# EAGLE design Sequencer-V10-024 (EAGLE 9.5.1)
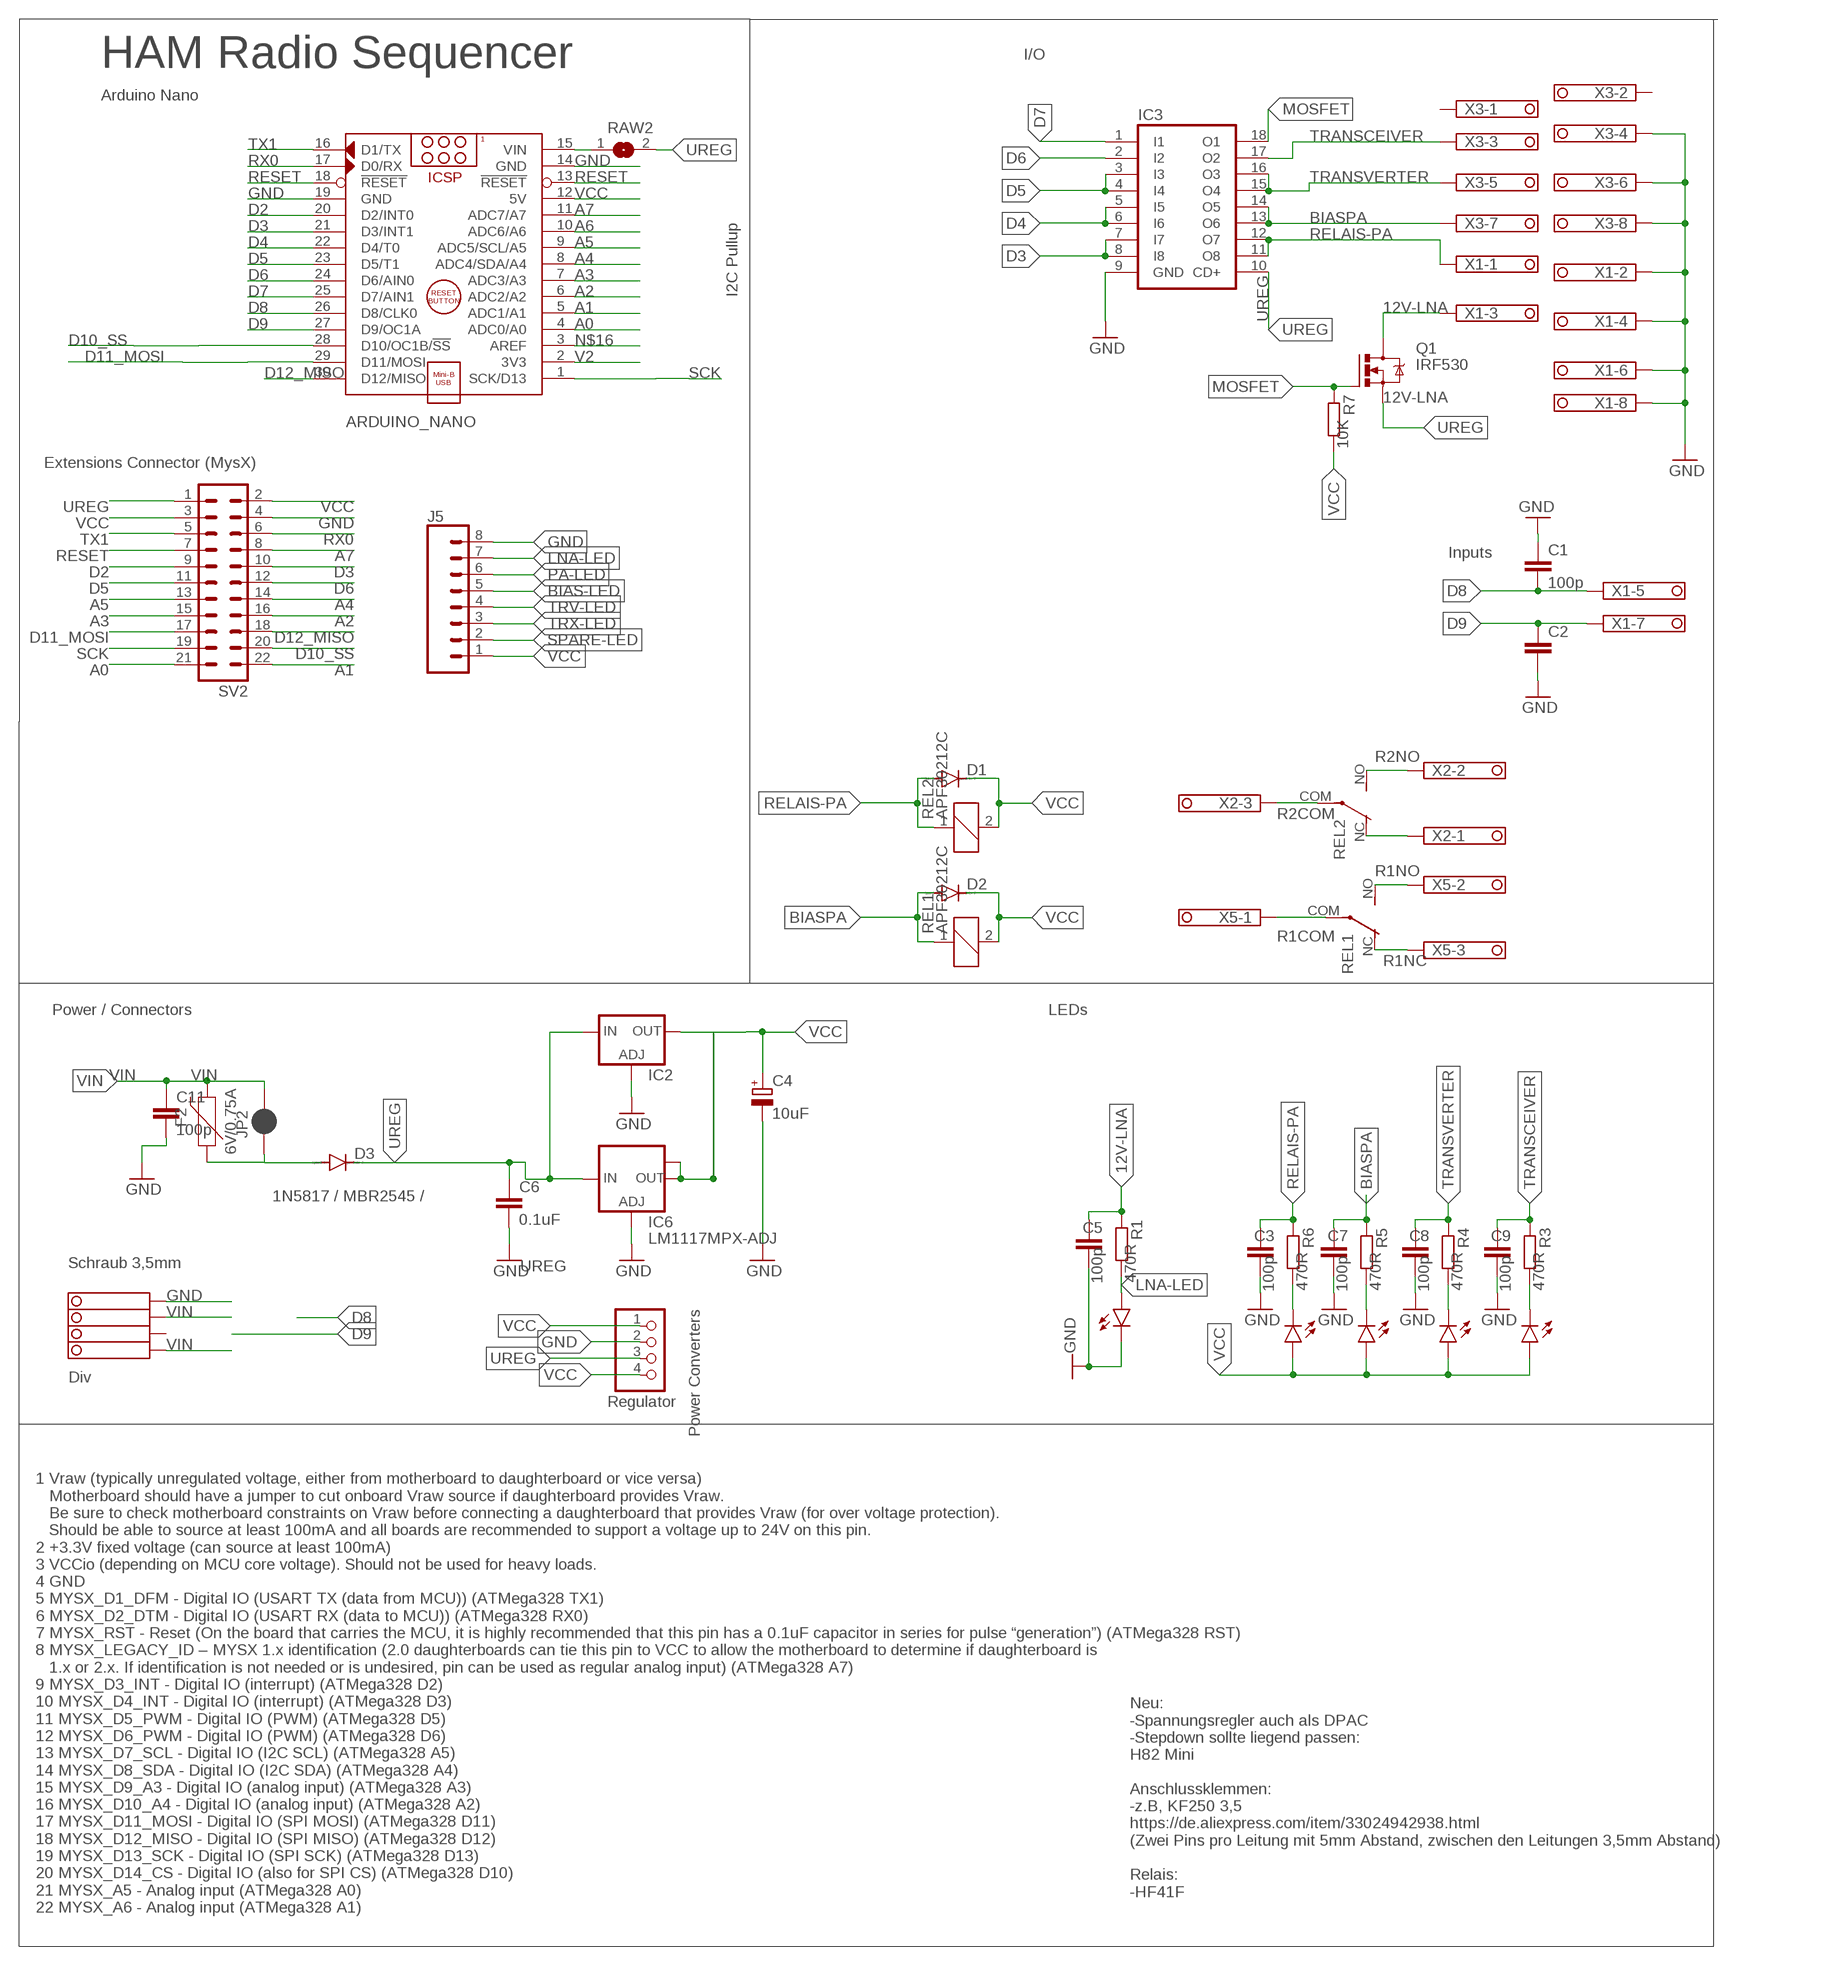
[diagram p0: schematic, sheet 1]

## Parts
ARDUINO_NANO  ARDUINO_NANO_OHNE-BOHR  [ARDUINO_NANO]
C1  100p  C-EU025-025X050  [C025-025X050]
C2  C-EU025-025X050  [C025-025X050]
C3  100p  C-EU025-025X050  [C025-025X050]
C4  10uF  CPOL-EUE3.5-8  [E3,5-8]
C5  100p  C-EU025-025X050  [C025-025X050]
C6  0.1uF  C-EU050-024X044  [C050-024X044]
C7  100p  C-EU025-025X050  [C025-025X050]
C8  100p  C-EU025-025X050  [C025-025X050]
C9  100p  C-EU025-025X050  [C025-025X050]
C11  100p  C-EU025-025X050  [C025-025X050]
D1  DIODE-D-2.5  [D-2.5]
D2  DIODE-D-2.5  [D-2.5]
D3  1N5817 / MBR2545 /  DIODE-D-7.5  [D-7.5]
F2  6V/0.75A  PPTC_THREE-QUARTER-AMP  [1206]
IC2  LD117ADT50TR  [DPACK]
IC3  ULN2803A  [DIL18]
IC6  LM1117MPX-ADJ  [SOT223]
J5  CONN_08LOCK  [1X08_LOCK]
JP2  JUMPER-SMT_2_NC_PASTE_NO-SILK  [SMT-JUMPER_2_NC_PASTE_NO-SILK]
LED-BIAS  LED3MM  [LED3MM]
LED-LNA  LED3MM  [LED3MM]
LED-PA  LED3MM  [LED3MM]
LED-TRV  LED3MM  [LED3MM]
LED-TRX  LED3MM  [LED3MM]
Q1  IRF530  [TO220BV]
R1  470R  R-EU_0207/7  [0207/7]
R3  470R  R-EU_0207/7  [0207/7]
R4  470R  R-EU_0207/7  [0207/7]
R5  470R  R-EU_0207/7  [0207/7]
R6  470R  R-EU_0207/7  [0207/7]
R7  10K  R-EU_0207/7  [0207/7]
RAW2  SJ  [SJ]
REL1  APF30212C  [APF30212C]
REL2  APF30212C  [APF30212C]
STEPDWN  PINHD-1X04_2.54-S  [1X04-S]
SV2  MA11-2  [MA11-2]
X1  MARTIN8X2-1751303  [1751303]
X2  MARTIN3X2-1751303175L303-3  [1751303-3]
X3  MARTIN8X2-1751303  [1751303]
X4  1751264  [1751264]
X5  MARTIN3X2-1751303175L303-3  [1751303-3]

## Nets
12V-LNA: C5.1 Q1.D R1.1 X1.11
A0 [Signal]: ARDUINO_NANO.4(ADC0/A0) SV2.21
A1 [Signal]: ARDUINO_NANO.5(ADC1/A1) SV2.22
A2 [Signal]: ARDUINO_NANO.6(ADC2/A2) SV2.16
A3 [Signal]: ARDUINO_NANO.7(ADC3/A3) SV2.15
A4 [Signal]: ARDUINO_NANO.8(ADC4/SDA/A4) SV2.14
A5 [Signal]: ARDUINO_NANO.9(ADC5/SCL/A5) SV2.13
A6 [Signal]: ARDUINO_NANO.10(ADC6/A6)
A7 [Signal]: ARDUINO_NANO.11(ADC7/A7) SV2.8
BIAS-LED [Signal]: J5.5 LED-BIAS.K(C) R5.2
BIASPA: C7.1 D2.A IC3.13(O6) IC3.14(O5) R5.1 REL1.1 X3.15
D2 [Signal]: ARDUINO_NANO.20(D2/INT0) SV2.9
D3 [Signal]: ARDUINO_NANO.21(D3/INT1) IC3.7(I7) IC3.8(I8) SV2.10
D4 [Signal]: ARDUINO_NANO.22(D4/T0) IC3.5(I5) IC3.6(I6)
D5 [Signal]: ARDUINO_NANO.23(D5/T1) IC3.3(I3) IC3.4(I4) SV2.11
D6 [Signal]: ARDUINO_NANO.24(D6/AIN0) IC3.2(I2) SV2.12
D7 [Signal]: ARDUINO_NANO.25(D7/AIN1) IC3.1(I1)
D8 [Signal]: ARDUINO_NANO.26(D8/CLK0) C1.2 X1.13
D9 [Signal]: ARDUINO_NANO.27(D9/OC1A) C2.1 X1.15
D10_SS [Signal]: ARDUINO_NANO.28(D10/OC1B/!SS) SV2.20
D11_MOSI [Signal]: ARDUINO_NANO.29(D11/MOSI) SV2.17
D12_MISO [Signal]: ARDUINO_NANO.30(D12/MISO) SV2.18
GND [Power]: ARDUINO_NANO.14(GND) ARDUINO_NANO.19(GND) C1.1 C2.2 C3.2 C4.- C5.2 C6.2 C7.2 C8.2 C9.2 C11.2 IC2.1(ADJ) IC3.9(GND) IC6.1(ADJ) J5.8 LED-LNA.K(C) STEPDWN.2 SV2.4 X1.10 X1.12 X1.14 X1.16 X3.12 X3.14 X3.16 X4.4
LNA-LED [Signal]: J5.7 LED-LNA.A R1.2
MOSFET: IC3.18(O1) Q1.G R7.1
N$1: D3.A F2.1 JP2.1
N$16: ARDUINO_NANO.3(AREF)
PA-LED [Signal]: J5.6 LED-PA.K(C) R6.2
R1COM: REL1.COM(2:P) X5.1
R1NC: REL1.NC(2:O) X5.3
R1NO: REL1.NO(2:S) X5.2
R2COM: REL2.COM(2:P) X2.3
R2NC: REL2.NC(2:O) X2.1
R2NO: REL2.NO(2:S) X2.2
RAW1 [Power]: ARDUINO_NANO.15(VIN) RAW2.1
RELAIS-PA: C3.1 D1.A IC3.11(O8) IC3.12(O7) R6.1 REL2.1 X1.9
RESET [Signal]: ARDUINO_NANO.13(!RESET) ARDUINO_NANO.18(!RESET) SV2.7
RX0 [Signal]: ARDUINO_NANO.17(D0/RX) SV2.6
SCK [Signal]: ARDUINO_NANO.1(SCK/D13) SV2.19
SPARE-LED [Signal]: J5.2
TRANSCEIVER: C9.1 IC3.17(O2) R3.1 X3.11
TRANSVERTER: C8.1 IC3.15(O4) IC3.16(O3) R4.1 X3.13
TRV-LED [Signal]: J5.4 LED-TRV.K(C) R4.2
TRX-LED [Signal]: J5.3 LED-TRX.K(C) R3.2
TX1 [Signal]: ARDUINO_NANO.16(D1/TX) SV2.5
UREG [Power]: C6.1 D3.C IC2.3(IN) IC3.10(CD+) IC6.3(IN) Q1.S RAW2.2 STEPDWN.3 SV2.1
V2 [Power]: ARDUINO_NANO.2(3V3)
VCC [Power]: ARDUINO_NANO.12(5V) C4.+ D1.C D2.C IC2.4(OUT) IC6.2(OUT) IC6.TAB(OUT1) J5.1 LED-BIAS.A LED-PA.A LED-TRV.A LED-TRX.A R7.2 REL1.2 REL2.2 STEPDWN.1 STEPDWN.4 SV2.2 SV2.3
VIN [Power]: C11.1 F2.2 JP2.2 X4.1 X4.3
Unconnected: X3.9 X3.10 X4.2

## Notes on the sheet
- I/O
- HAM Radio Sequencer
- Arduino Nano
- I2C Pullup
- Extensions Connector (MysX)
- Inputs
- Power / Connectors | LEDs
- Schraub 3,5mm
- Power Converters
- Div
- Regulator
- Neu:
  -Spannungsregler auch als DPAC
  -Stepdown sollte liegend passen:  
  H82 Mini
  
  Anschlussklemmen:
  -z.B, KF250 3,5 
  https://de.aliexpress.com/item/33024942938.html
  (Zwei Pins pro Leitung mit 5mm Abstand, zwischen den Leitungen 3,5mm Abstand)
  
  Relais:
  -HF41F
- 1 Vraw (typically unregulated voltage, either from motherboard to daughterboard or vice versa)
     Motherboard should have a jumper to cut onboard Vraw source if daughterboard provides Vraw. 
     Be sure to check motherboard constraints on Vraw before connecting a daughterboard that provides Vraw (for over voltage protection). 
     Should be able to source at least 100mA and all boards are recommended to support a voltage up to 24V on this pin.
  2 +3.3V fixed voltage (can source at least 100mA)
  3 VCCio (depending on MCU core voltage). Should not be used for heavy loads.
  4 GND
  5 MYSX_D1_DFM - Digital IO (USART TX (data from MCU)) (ATMega328 TX1)
  6 MYSX_D2_DTM - Digital IO (USART RX (data to MCU)) (ATMega328 RX0)
  7 MYSX_RST - Reset (On the board that carries the MCU, it is highly recommended that this pin has a 0.1uF capacitor in series for pulse “generation”) (ATMega328 RST)
  8 MYSX_LEGACY_ID – MYSX 1.x identification (2.0 daughterboards can tie this pin to VCC to allow the motherboard to determine if daughterboard is 
     1.x or 2.x. If identification is not needed or is undesired, pin can be used as regular analog input) (ATMega328 A7)
  9 MYSX_D3_INT - Digital IO (interrupt) (ATMega328 D2)
  10 MYSX_D4_INT - Digital IO (interrupt) (ATMega328 D3)
  11 MYSX_D5_PWM - Digital IO (PWM) (ATMega328 D5)
  12 MYSX_D6_PWM - Digital IO (PWM) (ATMega328 D6)
  13 MYSX_D7_SCL - Digital IO (I2C SCL) (ATMega328 A5)
  14 MYSX_D8_SDA - Digital IO (I2C SDA) (ATMega328 A4)
  15 MYSX_D9_A3 - Digital IO (analog input) (ATMega328 A3)
  16 MYSX_D10_A4 - Digital IO (analog input) (ATMega328 A2)
  17 MYSX_D11_MOSI - Digital IO (SPI MOSI) (ATMega328 D11)
  18 MYSX_D12_MISO - Digital IO (SPI MISO) (ATMega328 D12)
  19 MYSX_D13_SCK - Digital IO (SPI SCK) (ATMega328 D13)
  20 MYSX_D14_CS - Digital IO (also for SPI CS) (ATMega328 D10)
  21 MYSX_A5 - Analog input (ATMega328 A0)
  22 MYSX_A6 - Analog input (ATMega328 A1)

## Library data of the parts
ARDUINO_NANO = ArduinoNanoV30:ARDUINO_NANO_OHNE-BOHR: Arduino Nano V3.0 Module Overview: The Arduino Nano is a small, complete, and breadboard-friendly board based on the ATmega328 (Arduino Nano 3.x) or ATmega168 (Arduino Nano 2.x). It has more or less the same functionality of the Arduino Duemilanove, but in a different package. It lacks only a DC power jack, and works with a Mini-B USB cable instead of a standard one. The Nano was designed and is being produced by Gravitech <http://www.gravitech.us/arna30wiatp.html>. General specifications: Item Value Microcontroller Atmel ATmega168 or ATmega328 Operating Voltage (logic level) 5 V Input Voltage (recommended) 7-12 V Input Voltage (limits) 6-20 V Digital I/O Pins 14 (of which 6 provide PWM output) Analog Input Pins 8 DC Current per I/O Pin 40 mA Flash Memory 16 KB (ATmega168) or 32 KB (ATmega328) of which 2 KB used by bootloader SRAM 1 KB (ATmega168) or 2 KB (ATmega328) EEPROM 512 bytes (ATmega168) or 1 KB (ATmega328) Clock Speed 16 MHz Dimensions (Inches) 0.73" x 1.70" Dimensions (mm) 18mm x 45mm Overall height About 9 mm (not including pins) Weigth 5 g Power: The Arduino Nano can be powered via the Mini-B USB connection, 6-20V unregulated external power supply (pin 30), or 5V regulated external power supply (pin 27). The power source is automatically selected to the highest voltage source. Memory: The ATmega168 has 16 KB of flash memory for storing code (of which 2 KB is used for the bootloader); the ATmega328 has 32 KB, (also with 2 KB used for the bootloader). The ATmega168 has 1 KB of SRAM and 512 bytes of EEPROM (which can be read and written with the EEPROM library); the ATmega328 has 2 KB of SRAM and 1 KB of EEPROM. Input and Output: Each of the 14 digital pins on the Nano can be used as an input or output, using pinMode(), digitalWrite(), and digitalRead() functions. They operate at 5 volts. Each pin can provide or receive a maximum of 40 mA and has an internal pull-up resistor (disconnected by default) of 20-50 kOhms. In addition, some pins have specialized functions. Visit Arduino - ArduinoBoardNano <https://www.arduino.cc/en/Main/ArduinoBoardNano>
C1-C3 C5-C9 C11 = rcl:C-EU: CAPACITOR, European symbol; SPICEPREFIX: C
C4 = rcl:CPOL-EU: POLARIZED CAPACITOR, European symbol; SPICEPREFIX: C
D1-D3 = diode:DIODE-: DIODE
F2 = SparkFun-Fuses:PPTC: Resettable Fuse PPTC Resettable Fuse. Really a sort of resistor with a polymeric positive temperature coefficient whose resistance increases dramatically with an increase in temperature. When heated by the power passing through the resistance rises causing the current to be limited, protecting the circuit. This is achieved by the transition of the polymer from a crystalline to an amorphous state where the conductive carbon separates breaking the conductive pathways found in the cool crystalline structure. When a PPTC cools back down it resumes conducting letting the circuit turn back on. SparkFun Products: SparkFun RedBoard - Programmed with Arduino <https://www.sparkfun.com/products/12757> Pro Micro - 5V/16MHz <https://www.sparkfun.com/products/12640> Arduino Pro 328 - 5V/16MHz <https://www.sparkfun.com/products/10915> MP3 Trigger <https://www.sparkfun.com/products/13720>; PROD_ID: RES-11150
IC2 = v-reg:LD117A?*: Low drop fixed and adjustable positive voltage regulators 1 A Source: http://www.st.com/stonline/products/literature/ds/7194/ld1117axx.pdf
IC3 = uln-udn:ULN2803A: DRIVER ARRAY
IC6 = lm1117:LM1117MPX-ADJ
J5 = SparkFun-Connectors:CONN_08: Multi connection point. Often used as Generic Header-pin footprint for 0.1 inch spaced/style header connections On any of the 0.1 inch spaced packages, you can populate with these: Break Away Headers - Straight <https://www.sparkfun.com/products/116> (PRT-00116) Break Away Male Headers - Right Angle <https://www.sparkfun.com/products/553> (PRT-00553) Female Headers <https://www.sparkfun.com/products/115> (PRT-00115) Break Away Headers - Machine Pin <https://www.sparkfun.com/products/117> (PRT-00117) Break Away Female Headers - Swiss Machine Pin <https://www.sparkfun.com/products/743> (PRT-00743) Arduino Stackable Header - 8 Pin <https://www.sparkfun.com/products/9279> (PRT-09279) For SCREWTERMINALS and SPRING TERMINALS visit here: Screw Terimnals on SparkFun.com <https://www.sparkfun.com/search/results?term=Screw+Terminals> (5mm/3.5mm/2.54mm spacing) This device is also useful as a general connection point to wire up your design to another part of your project. Our various solder wires solder well into these plated through hole pads. Hook-Up Wire - Assortment (Stranded, 22 AWG) <https://www.sparkfun.com/products/11375> (PRT-11375) Hook-Up Wire - Assortment (Solid Core, 22 AWG) <https://www.sparkfun.com/products/11367> (PRT-11367) View the entire wire category on our website here <https://www.sparkfun.com/categories/141> Special notes: Molex polarized connector foot print use with SKU : PRT-08231 with associated crimp pins and housings. 1MM SMD Version SKU: PRT-10208 NOTES ON THE VARIANTS LOCK and LOCK_LONGPADS... This footprint was designed to help hold the alignment of a through-hole component (i.e. 6-pin header) while soldering it into place. You may notice that each hole has been shifted either up or down by 0.005 of an inch from it's more standard position (which is a perfectly straight line). This slight alteration caused the pins (the squares in the middle) to touch the edges of the holes. Because they are alternating, it causes a "brace" to hold the component in place. 0.005 has proven to be the perfect amount of "off-center" position when using our standard breakaway headers. Although looks a little odd when you look at the bare footprint, once you have a header in there, the alteration is very hard to notice. Also,if you push a header all the way into place, it is covered up entirely on the bottom side.
JP2 = SparkFun-Jumpers:JUMPER-SMT_2_NC_PASTE: Normally closed solder jumper This jumper has an aperture in the stencil to allow solder paste to bridge the split in the wire so it's normally closed (NC). Wick off the solder to open the connection. Reapply solder to reclose the connection.
LED-BIAS LED-LNA LED-PA LED-TRV LED-TRX = led:LED: LED OSRAM: - CHIPLED LG R971, LG N971, LY N971, LG Q971, LY Q971, LO R971, LY R971 LH N974, LH R974 LS Q976, LO Q976, LY Q976 LO Q996 - Hyper CHIPLED LW Q18S LB Q993, LB Q99A, LB R99A - SideLED LS A670, LO A670, LY A670, LG A670, LP A670 LB A673, LV A673, LT A673, LW A673 LH A674 LY A675 LS A676, LA A676, LO A676, LY A676, LW A676 LS A679, LY A679, LG A679 - Hyper Micro SIDELED® LS Y876, LA Y876, LO Y876, LY Y876 LT Y87S - SmartLED LW L88C, LW L88S LB L89C, LB L89S, LG L890 LS L89K, LO L89K, LY L89K LS L896, LA L896, LO L896, LY L896 - TOPLED LS T670, LO T670, LY T670, LG T670, LP T670 LSG T670, LSP T670, LSY T670, LOP T670, LYG T670 LG T671, LOG T671, LSG T671 LB T673, LV T673, LT T673, LW T673 LH T674 LS T676, LA T676, LO T676, LY T676, LB T676, LH T676, LSB T676, LW T676 LB T67C, LV T67C, LT T67C, LS T67K, LO T67K, LY T67K, LW E67C LS E67B, LA E67B, LO E67B, LY E67B, LB E67C, LV E67C, LT E67C LW T67C LS T679, LY T679, LG T679 LS T770, LO T770, LY T770, LG T770, LP T770 LB T773, LV T773, LT T773, LW T773 LH T774 LS E675, LA E675, LY E675, LS T675 LS T776, LA T776, LO T776, LY T776, LB T776 LHGB T686 LT T68C, LB T68C - Hyper Mini TOPLED® LB M676 - Mini TOPLED Santana® LG M470 LS M47K, LO M47K, LY M47K Source: http://www.osram.convergy.de LUXEON: - LUMILED® LXK2-PW12-R00, LXK2-PW12-S00, LXK2-PW14-U00, LXK2-PW14-V00 LXK2-PM12-R00, LXK2-PM12-S00, LXK2-PM14-U00 LXK2-PE12-Q00, LXK2-PE12-R00, LXK2-PE12-S00, LXK2-PE14-T00, LXK2-PE14-U00 LXK2-PB12-K00, LXK2-PB12-L00, LXK2-PB12-M00, LXK2-PB14-N00, LXK2-PB14-P00, LXK2-PB14-Q00 LXK2-PR12-L00, LXK2-PR12-M00, LXK2-PR14-Q00, LXK2-PR14-R00 LXK2-PD12-Q00, LXK2-PD12-R00, LXK2-PD12-S00 LXK2-PH12-R00, LXK2-PH12-S00 LXK2-PL12-P00, LXK2-PL12-Q00, LXK2-PL12-R00 Source: www.luxeon.com KINGBRIGHT: KA-3528ASYC Source: www.kingbright.com
Q1 = transistor-power:IRF530: HEXFET Power MOSFET
R1 R3-R7 = rcl:R-EU_: RESISTOR, European symbol; SPICEPREFIX: R
RAW2 = jumper:SJ: SMD solder JUMPER
REL1 REL2 = relay:APF30212C: Compliant with European standards 1a/1c 6A Slim power relays Source: Data sheet <http://pewa.panasonic.com/assets/pcsd/catalog/pf-catalog.pdf>; OC_FARNELL: unknown
STEPDWN = pinhead-2:PINHD-1X04: PIN HEADER
SV2 = con-Pinheader:MA11-2: PIN HEADER; OC_FARNELL: unknown; OC_NEWARK: unknown
X1 X3 = con-phoenix-350-Martin:MARTIN8X2-1751303: MKDS 1/ 8-3,5 Printklemme Nennstrom: 10 A Bemessungsspannung: 160 V Raster: 3,5 mm Polzahl: 8 Montageart: Löten Anschlussart: Schraubanschluss Anschlussrichtung vom Leiter zur Platine: 0° Source: http://eshop.phoenixcontact.com .. .pdf; OC_FARNELL: unknown; OC_NEWARK: unknown
X2 X5 = con-phoenix-350-Martin:MARTIN3X2-1751303: MKDS 1/ 8-3,5 Printklemme Nennstrom: 10 A Bemessungsspannung: 160 V Raster: 3,5 mm Polzahl: 8 Montageart: Löten Anschlussart: Schraubanschluss Anschlussrichtung vom Leiter zur Platine: 0° Source: http://eshop.phoenixcontact.com .. .pdf
X4 = con-phoenix-350:1751264: MKDS 1/ 4-3,5 Printklemme Nennstrom: 10 A Bemessungsspannung: 160 V Raster: 3,5 mm Polzahl: 4 Montageart: Löten Anschlussart: Schraubanschluss Anschlussrichtung vom Leiter zur Platine: 0° Source: http://eshop.phoenixcontact.com .. 1751264.pdf; MPN: 1751264; OC_FARNELL: unknown; OC_NEWARK: 10R0934

## Net classes
0 default: width 1.219 mm
1 Power: width 0.762 mm
2 Signal: width 0.305 mm

## Board
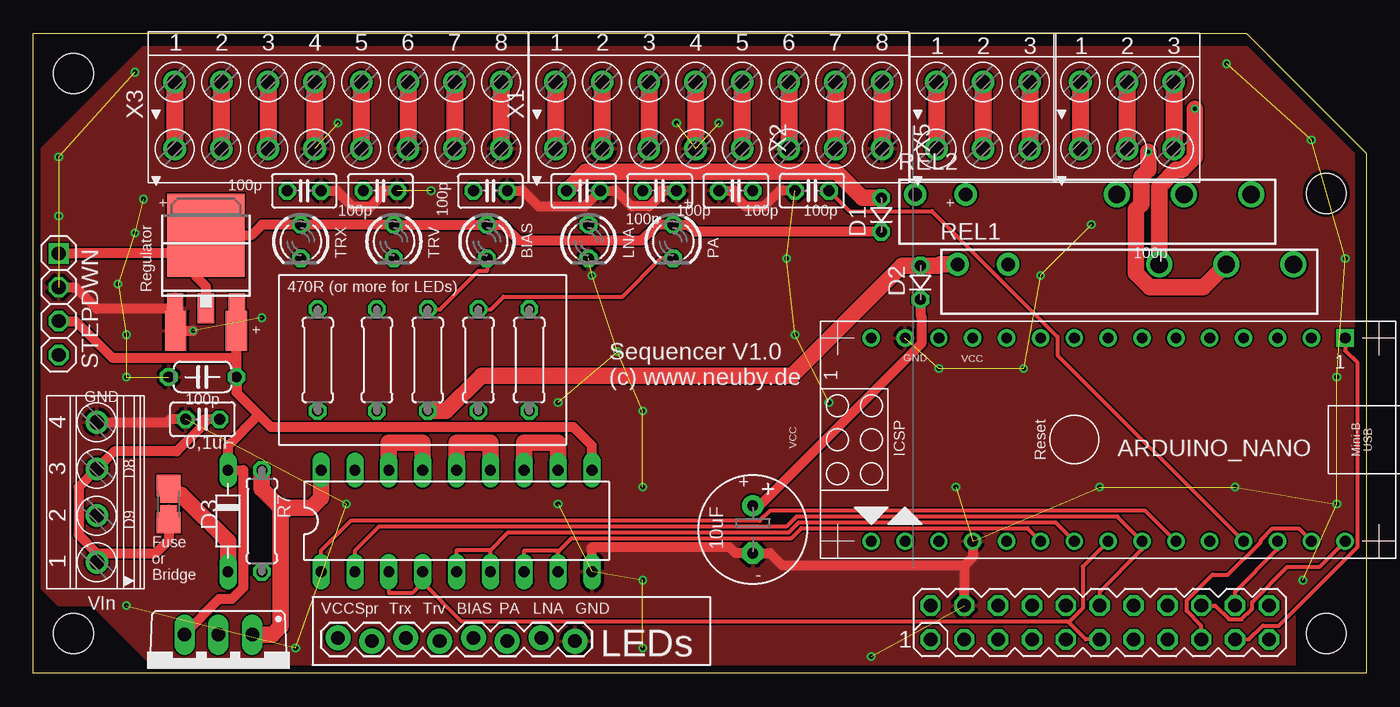
[diagram p1: board, top side]
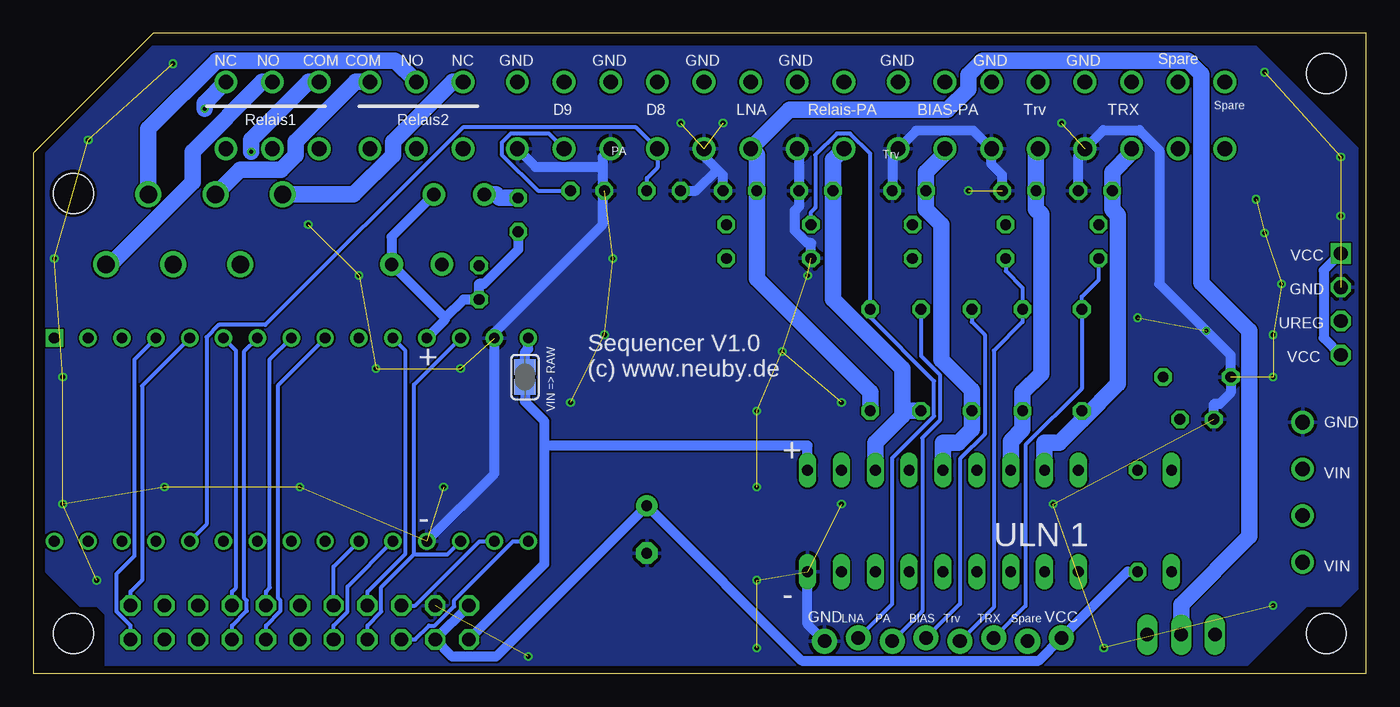
[diagram p2: board, bottom side, seen from below]

Size 100 x 48 mm. Coordinates in mm from the lower left corner, seen from the top.
Outline: 100,0 0,0 0,48 91,48 100,39 100,0
Copper layers (1*16): Top 0.035mm / dielectric 1.5mm / Bottom 0.035mm
Design rules "dirt_cheap_dirty_boards.v1": minimum track width 5mil, minimum drill 12mil, track to track 5mil, track to pad 5mil, pad to pad 5mil, via to via 5mil, smd to smd 0mil, copper to edge 10mil, drill to drill 10mil, minimum pad ring 10mil, minimum via ring 6mil, stop-mask expansion 2mil, vias tented up to drill 25mil, thermal gap 10mil
Holes 3 mm at 3,45 97,36 97,3 3,3

### Footprints (pad centres in the part's own frame; a part is rotated, then mirrored left to right if it is on the bottom)
ARDUINO_NANO = drill 0.8 square: 1 -20.32,-7.62 | drill 0.8: 2 -17.78,-7.62; 3 -15.24,-7.62; 4 -12.7,-7.62; 5 -10.16,-7.62; 6 -7.62,-7.62; 7 -5.08,-7.62; 8 -2.54,-7.62; 9 0,-7.62; 10 2.54,-7.62; 11 5.08,-7.62; 12 7.62,-7.62; 13 10.16,-7.62; 14 12.7,-7.62; 15 15.24,-7.62; 16 15.24,7.62; 17 12.7,7.62; 18 10.16,7.62; 19 7.62,7.62; 20 5.08,7.62; 21 2.54,7.62; 22 0,7.62; 23 -2.54,7.62; 24 -5.08,7.62; 25 -7.62,7.62; 26 -10.16,7.62; 27 -12.7,7.62; 28 -15.24,7.62; 29 -17.78,7.62; 30 -20.32,7.62
C025-025X050 = drill 0.813 octagon: 1 -1.27,0; 2 1.27,0
E3,5-8 = drill 0.813 pad 1.6: + -1.778,0 | drill 0.813 pad 1.6 octagon: - 1.778,0
C050-024X044 = drill 0.813 octagon: 1 -2.54,0; 2 2.54,0
D-2.5 = drill 0.813 octagon: A 1.27,0; C -1.27,0
D-7.5 = drill 0.813 long: A 3.81,0; C -3.81,0
1206 = smd 1.6 x 1.8: 1 -1.4,0; 2 1.4,0
DPACK = smd 1.6 x 3: 1 -2.28,-4.8; 3 2.28,-4.8 | smd 5.8 x 6.2: 4 0,2.38
DIL18 = drill 0.813 long: 1 -10.16,-3.81; 2 -7.62,-3.81; 3 -5.08,-3.81; 4 -2.54,-3.81; 5 0,-3.81; 6 2.54,-3.81; 7 5.08,-3.81; 8 7.62,-3.81; 9 10.16,-3.81; 10 10.16,3.81; 11 7.62,3.81; 12 5.08,3.81; 13 2.54,3.81; 14 0,3.81; 15 -2.54,3.81; 16 -5.08,3.81; 17 -7.62,3.81; 18 -10.16,3.81
SOT223 = smd 1.219 x 2.235: 1 -2.311,-3.099; 2 0,-3.099; 3 2.311,-3.099 | smd 3.6 x 2.2: TAB 0,3.099
1X08_LOCK = drill 1.016 pad 1.88: 1 0,0.127; 2 2.54,-0.127; 3 5.08,0.127; 4 7.62,-0.127; 5 10.16,0.127; 6 12.7,-0.127; 7 15.24,0.127; 8 17.78,-0.127
SMT-JUMPER_2_NC_PASTE_NO-SILK = smd 0.635 x 1.27: 1 -0.406,0; 2 0.406,0
LED3MM = drill 0.813 octagon: A -1.27,0; K 1.27,0
TO220BV = drill 1.016 long: D 0,-2.54; G -2.54,-2.54; S 2.54,-2.54
0207/7 = drill 0.813 octagon: 1 -3.81,0; 2 3.81,0
SJ = smd 1.168 x 1.6: 1 -0.762,0; 2 0.762,0
APF30212C = drill 1 pad 1.7: 1 -12.6,0; 2 -8.82,0 | drill 1.3 pad 1.9: COM 7.56,0; NC 2.52,0; NO 12.6,0
1X04-S = drill 1.016 square: 1 -3.81,0 | drill 1.016 octagon: 2 -1.27,0; 3 1.27,0; 4 3.81,0
MA11-2 = drill 1.016 octagon: 1 -12.7,-1.27; 2 -12.7,1.27; 3 -10.16,-1.27; 4 -10.16,1.27; 5 -7.62,-1.27; 6 -7.62,1.27; 7 -5.08,-1.27; 8 -5.08,1.27; 9 -2.54,-1.27; 10 -2.54,1.27; 11 0,-1.27; 12 0,1.27; 13 2.54,-1.27; 14 2.54,1.27; 15 5.08,-1.27; 16 5.08,1.27; 17 7.62,-1.27; 18 7.62,1.27; 19 10.16,-1.27; 20 10.16,1.27; 21 12.7,-1.27; 22 12.7,1.27
1751303 = drill 1.1 pad 1.7: 1 -12.25,-0.1; 2 -8.75,-0.1; 3 -5.25,-0.1; 4 -1.75,-0.1; 5 1.75,-0.1; 6 5.25,-0.1; 7 8.75,-0.1; 8 12.25,-0.1; 9 -12.25,-5.1; 10 -8.75,-5.1; 11 -5.25,-5.1; 12 -1.75,-5.1; 13 1.75,-5.1; 14 5.25,-5.1; 15 8.75,-5.1; 16 12.25,-5.1
1751303-3 = drill 1.1 pad 1.7: 1 -3.36,2.44; 2 0.14,2.44; 3 3.64,2.44; 4 -3.36,-2.56; 5 0.14,-2.56; 6 3.64,-2.56
1751264 = drill 1.1 pad 1.7: 1 -5.25,-0.1; 2 -1.75,-0.1; 3 1.75,-0.1; 4 5.25,-0.1

### Placement (x,y rotation side)
ARDUINO_NANO  78.11,17.52 180 top
C1  52.7,36.2 0 top
C2  58.42,36.2 180 top
C3  41.27,36.2 0 top
C4  53.98,10.79 270 top
C5  46.99,36.2 0 top
C6  12.7,22.23 180 top
C7  34.29,36.2 0 top
C8  26.04,36.2 0 top
C9  20.32,36.2 0 top
C11  12.7,19.05 180 top
D1  63.62,34.38 90 top
D2  66.56,29.3 90 top
D3  14.61,11.43 270 top
F2  10.16,12.7 270 top
IC2  12.96,30.48 0 top
IC3  31.75,11.43 0 top
IC6  12.96,30.48 0 top
J5  22.86,2.54 0 top
JP2  10.16,12.7 270 top
LED-BIAS  34.03,32.38 270 top
LED-LNA  41.66,32.38 270 top
LED-PA  48.01,32.38 270 top
LED-TRV  27.05,32.38 270 top
LED-TRX  20.07,32.38 270 top
Q1  13.88,0.36 180 top
R1  37.21,23.5 90 top
R3  21.34,23.5 90 top
R4  25.78,23.5 90 top
R5  29.59,23.5 90 top
R6  33.4,23.5 90 top
R7  17.14,11.43 270 top
RAW2  63.12,22.23 270 bottom
REL1  81.94,30.68 0 top
REL2  78.77,35.91 0 top
STEPDWN  1.91,27.68 270 top
SV2  80.01,3.81 0 top
X1  51.44,44.45 0 top
X2  71.12,41.91 0 top
X3  22.86,44.45 0 top
X4  4.67,13.59 90 top
X5  81.92,41.91 0 top

### Tracks (layer width: path | path; a pad name or v marks a point on that pad's centre or on a via)
12V-LNA
  Bottom 1.219: Q1.D 13.88,5.16 8.76,10.29 8.76,25.68 12.36,29.28 12.36,44.93 13.38,45.95 28.79,45.95 29.86,44.88 29.86,43.81 31.41,42.26 43.27,42.26 X1.11 45.72,38.88 C5.1 45.72,29.59 37.21,21.08 R1.1
A0
  Bottom 0.305: SV2.21 92.71,3.58 93.75,4.62 93.75,7.47 92.41,8.81 92.41,23.54 ARDUINO_NANO.4
A1
  Bottom 0.305: ARDUINO_NANO.5 91.85,21.56 91.85,6.99 92.71,6.12 SV2.22
A2
  Bottom 0.305: SV2.16 85.09,6.12 84.78,6.43 84.78,24.2 ARDUINO_NANO.6
A3
  Bottom 0.305: SV2.15 85.09,3.58 83.99,4.68 83.99,5.46 84.17,5.63 84.17,24.16 ARDUINO_NANO.7
A4
  Bottom 0.305: SV2.14 82.55,6.12 82.25,6.42 82.25,23.54 ARDUINO_NANO.8
A5
  Bottom 0.305: SV2.13 82.55,3.58 81.45,4.68 81.45,5.46 81.63,5.63 81.63,21.62 ARDUINO_NANO.9
A7
  Bottom 0.305: SV2.8 74.93,6.12 72.07,8.98 72.07,24.19 ARDUINO_NANO.11
BIAS-LED
  Top 0.305: LED-BIAS.K 34.03,30.18 33.4,30.18 30.53,27.3 R5.2
  Bottom 0.305: R5.2 29.59,26.36 28.62,25.39 28.62,17.94 30.48,16.08 30.48,5.21 J5.5
BIASPA
  Top 1.219: IC3.13 34.29,17.3 31.75,17.3 IC3.14 | R5.1 30.99,19.68 33.62,22.32 56.91,22.32 65.16,30.57 D2.A 67.26,30.57 67.96,30.57 68.06,30.68 REL1.1
  Bottom 1.219: IC3.14 31.75,17.3 30.58,17.3 29.59,18.29 R5.1 29.59,21.25 31.88,23.54 31.88,33.66 33.02,34.8 C7.1 33.02,37.59 31.61,39 X3.15
D2
  Bottom 0.305: SV2.9 77.47,3.58 76.43,4.62 76.43,6.5 ARDUINO_NANO.20
D3
  Top 0.305: 39.37,9.11 40.39,10.13 56.86,10.13 57.62,10.89 74.58,10.89 ARDUINO_NANO.21 | 39.37,9.11 39.26,9.22 36.83,9.22 IC3.7 | IC3.8 39.37,9.11
  Bottom 0.305: SV2.10 77.47,8 ARDUINO_NANO.21
D4
  Top 0.305: 34.29,9.22 35.64,10.57 56.69,10.57 57.44,11.32 76.69,11.32 ARDUINO_NANO.22 | 34.29,9.22 | IC3.6 34.29,9.11 34.29,9.22 | IC3.5 31.75,9.22 34.29,9.22
D5
  Top 0.305: 77.69,3.82 77.62,3.89 32.14,3.89 29.21,6.82 | 77.69,3.82 78.97,2.54 SV2.11 | ARDUINO_NANO.23 78.74,8 78.74,4.87 77.69,3.82 | IC3.3 26.67,6.02 28.41,6.02 29.21,6.82 | IC3.4 29.21,6.82
D6
  Top 0.305: IC3.2 24.13,9.22 25.91,11 56.51,11 57.26,11.76 81.33,11.76 ARDUINO_NANO.24 83.19,9.3 80.01,6.12 SV2.12
D7
  Top 0.305: ARDUINO_NANO.25 83.44,12.19 55.25,12.19 54.49,11.43 23.8,11.43 21.59,9.22 IC3.1
D8
  Bottom 0.305: ARDUINO_NANO.26 87,11.18 87,25.23 86.09,26.13 82.59,26.13 67.77,40.95 54.79,40.95 X1.13 53.19,37.92 53.98,37.13 53.98,36.66 C1.2
D9
  Top 0.305: C2.1 61.23,34.66 67.43,34.66 76.83,25.26 76.83,23.88 ARDUINO_NANO.27
  Bottom 0.305: X1.15 61.31,40.48 64.17,40.48 64.86,39.8 64.86,38.9 62.15,36.2 C2.1
D10_SS
  Top 0.305: SV2.20 90.17,6.12 93.34,9.3 ARDUINO_NANO.28
D11_MOSI
  Top 0.305: SV2.17 87.63,3.58 86.53,4.68 86.53,5.47 88.46,7.39 89.62,7.39 92.08,9.85 92.08,9.97 92.97,10.86 94.93,10.86 ARDUINO_NANO.29
D12_MISO
  Top 0.305: SV2.18 88.67,5.08 89.71,4.04 90.64,4.04 91.44,4.83 91.44,5.34 94.08,7.98 96.5,7.98 ARDUINO_NANO.30
GND  (via drill 0.3 pad 0.61, 0.35)  (41 unrouted)
  Top 0.762: C11.2 10.26,19.05 10.05,18.84 X4.4 | STEPDWN.2 3.17,28.95 4.79,27.34 10.64,27.34 | 10.64,27.34 10.64,27.3 10.64,27.12 10.64,25.75 10.68,25.72 IC2.1 v11.98,25.68 | IC6.1 10.64,27.34 | C7.2 36.73,36.2 37.91,35.01 41.36,35.01 C3.2 43.71,36.2 44.88,35.03 46.22,35.03 47.09,35.9 47.09,36.2 C5.2 | 69.85,8.09 56.21,8.09 55.28,9.02 C4.- 52.67,9.02 52.23,9.45 41.91,9.45 IC3.9 | ARDUINO_NANO.19 70.48,8.72 69.85,8.09 | 69.85,8.09 69.85,6.35 SV2.4 | C8.2 26.14,36.2 26.14,35.83 25.33,35.03 23.93,35.03 22.76,36.2 C9.2 | C1.1 52.6,36.2 52.6,35.83 53.44,34.99 54.78,34.99 55.98,36.2 C2.2
  Bottom 0.762: 57.26,36.2 57.26,33.7 65.41,25.55 ARDUINO_NANO.14 65.41,14.98 ARDUINO_NANO.19 | 57.26,37.99 57.26,38.77 X1.14 | 57.26,36.2 57.26,37.99 | X1.16 62.32,37.99 57.26,37.99 | C2.2 57.26,36.2 | C11.2 11.43,20.22 11,20.22 10.16,21.06 C6.2 10.16,23.86 v11.98,25.68 15.52,29.22 15.52,39.24 17.02,40.73 19.73,40.73 X3.12 21.59,38.87 C9.2 | 48.68,37.78 48.26,37.36 C5.2 | X1.12 49.69,38.79 48.68,37.78 | 48.68,37.78 50.27,36.2 C1.1 | C8.2 27.3,37.36 28.11,38.17 X3.14 29.47,40.71 33.75,40.71 X3.16 35.56,38.9 C7.2 | LED-LNA.K 41.66,32.28 41.95,32.28 42.86,33.2 42.86,34.71 42.55,35.03 C3.2 42.55,39.21 X1.10 | J5.8 41.91,3.68 IC3.9
  other vias: 1.91,38.73 7.62,45.09 7.62,33.02 6.35,29.21 6.99,25.4 6.99,22.23 6.99,5.08 19.68,1.91 23.5,12.7 17.14,26.67 29.84,36.2 41.91,29.84 43.81,24.13 39.37,20.32 59.69,20.32 39.37,12.7 45.72,1.91 45.72,6.99 45.72,13.97 45.72,19.68 56.52,31.11 57.15,25.4 62.87,1.27 69.22,13.97 67.94,22.86 75.56,29.84 79.38,33.66 89.53,45.72 95.89,40.01 98.42,31.11 97.79,22.23 97.79,12.7 90.17,13.97 80.01,13.97 74.3,22.86 95.25,6.99 1.91,34.29 8.26,35.56 22.86,41.27 48.26,41.27 51.44,41.27
  pour Top: 0.64,6.35 0.64,39.37 8.26,46.99 91.08,46.99 99.06,39.01 99.06,7.62 96.52,5.08 95.25,5.08 94.61,4.45 94.61,0.64 8.89,0.64 4.45,5.08 1.91,5.08
  pour Bottom: 8.89,0.64 4.45,5.08 1.91,5.08 0.64,6.35 0.64,39.37 8.26,46.99 91.08,46.99 99.06,39.01 99.06,7.62 96.52,5.08 95.25,5.08 94.61,4.45 94.61,0.64
LNA-LED
  Bottom 0.305: J5.7 35.56,5.21 35.56,16.15 32.43,19.29 32.43,21.91 37.21,26.69 R1.2 37.21,38.97 38.72,40.48 39.72,40.48 41.32,38.88 41.32,34.93 41.66,34.59 LED-LNA.A
MOSFET
  Top 1.219: 18.56,12.43 17.14,13.84 R7.1 | 18.56,12.43 18.56,3.54 17.92,2.9 Q1.G | 18.56,12.43 20.84,12.43 21.59,13.18 IC3.18
N$1
  Top 0.635: 10.16,13.4 JP2.1
  Top 1.219: D3.A 14.61,9.89 11.1,13.4 10.16,13.4 F2.1
PA-LED
  Top 0.305: LED-PA.K 47.06,31.11 44.2,28.25 35.28,28.25 34.34,27.3 R6.2
  Bottom 0.305: R6.2 33.4,23.8 31.99,22.39 31.99,18.98 33.31,17.66 33.31,4.67 J5.6
R1COM  (via drill 0.3 pad 0.61)
  Top 1.219: v83.64,39.11 83.64,37.76 83.12,37.24 83.12,35.16 82.73,34.77 82.73,29.99 83.77,28.95 87.78,28.95 REL1.COM
  Bottom 1.219: X5.1 79.33,44.35 83.64,40.03 v83.64,39.11
R1NC  (via drill 0.3 pad 0.61)
  Top 1.219: v87.14,42.36 87.14,38.69 86.22,37.76 85.72,37.76 84.47,36.51 REL1.NC
  Bottom 1.219: X5.3 87.14,42.76 v87.14,42.36
R1NO
  Bottom 1.219: REL1.NO 94.18,30.68 88.04,36.82 88.04,39.12 82.81,44.35 X5.2
R2COM
  Bottom 1.219: X2.3 75.83,44.35 80.31,39.88 80.31,38.85 81.39,37.76 84.48,37.76 REL2.COM
R2NC
  Bottom 1.219: X2.1 68.55,44.35 73.01,39.89 73.01,38.86 75.95,35.91 REL2.NC
R2NO
  Bottom 1.219: REL2.NO 91.37,40.83 86.26,45.94 72.85,45.94 X2.2
RAW1
  Bottom 0.762: RAW2.1 63.12,24.08 62.87,24.33 ARDUINO_NANO.15
RELAIS-PA
  Top 1.219: D1.A 62.22,35.66 60.27,37.61 41.42,37.61 C3.1 | IC3.11 39.37,17.3 36.83,17.3 IC3.12
  Bottom 1.219: 34.8,19.68 34.8,22.85 40.01,28.05 40.01,34.8 C3.1 40.01,38.53 X1.9 | D1.A 65.02,35.66 65.28,35.91 REL2.1 | R6.1 34.8,19.68 | 34.8,19.68 34.8,19.33 36.83,17.3 IC3.12
RESET
  Bottom 0.305: 71.44,8.93 68.92,8.93 ARDUINO_NANO.18 | 71.44,8.93 73.89,6.47 73.89,4.62 74.93,3.58 SV2.7 | 71.44,8.93 71.44,21.65 ARDUINO_NANO.13
RX0
  Bottom 0.305: SV2.6 71.35,5.08 66.52,9.9 ARDUINO_NANO.17
SCK
  Top 0.305: ARDUINO_NANO.1 98.42,24.21 99.36,23.28 99.36,9.49 93.44,3.58 92.25,3.58 91.21,2.54 SV2.19
TRANSCEIVER
  Bottom 1.219: IC3.17 24.13,17.3 23.02,17.3 21.34,18.99 | 21.34,18.99 18.62,21.7 18.62,34.37 19.05,34.8 C9.1 19.05,37.59 17.61,39.03 X3.11 | R3.1 21.34,18.99
TRANSVERTER
  Top 1.219: IC3.15 29.21,17.3 26.67,17.3 IC3.16
  Bottom 1.219: X3.13 24.77,39.2 C8.1 24.77,34.8 24.38,34.41 24.38,22.48 25.78,21.08 R4.1 25.78,18.99 25.78,18.29 26.67,17.4 IC3.16
TRV-LED
  Bottom 0.305: J5.4 27.94,4.95 27.94,24.2 25.78,26.36 R4.2 25.78,28.91 27.05,30.18 LED-TRV.K
TRX-LED
  Bottom 0.305: J5.3 25.55,5.06 25.55,17.13 21.34,21.35 R3.2 21.34,28.25 20.07,29.52 LED-TRX.K
TX1
  Bottom 0.305: SV2.5 71.35,2.54 70.31,3.58 69.88,3.58 68.43,5.03 68.43,5.48 64.01,9.9 ARDUINO_NANO.16
UREG
  Top 0.762: Q1.S 11.35,2.99 13.94,5.58 14.91,5.58 15.77,6.45 15.77,15.24 D3.C 14.61,17.07 16.92,19.38 | 16.92,19.38 15.24,21.06 C6.1 15.24,23.67 15.23,23.67 | 16.92,19.38 17.83,18.47 40.51,18.47 41.91,17.07 IC3.10 | STEPDWN.3 3.17,26.41 5.92,23.67 15.23,23.67 | 15.23,23.67 IC2.3 15.27,25.71 IC6.3
  Bottom 0.762: 61.65,17.07 61.65,18.9 63.12,20.37 RAW2.2 | SV2.1 61.65,8.2 61.65,17.07 | 61.65,17.07 41.91,17.07 IC3.10
VCC
  Top 0.762: D1.C 49.71,33.12 49.17,33.66 LED-PA.A 46.84,33.66 45.65,32.46 36.39,32.46 35.2,33.66 LED-BIAS.A LED-TRV.A LED-TRX.A 17.16,33.66 16.36,32.86 IC2.4 | C4.+ 54.49,12.57 66.62,24.7 66.62,26.81 66.56,26.87 D2.C | IC6.2 12.96,29.01 12.25,29.71 12.25,31.5 | 12.25,31.5 12.25,32.86 IC2.4 | 12.25,31.5 3.17,31.5 STEPDWN.1 | IC6.TAB IC2.4
  Bottom 0.762: SV2.2 SV2.3 68.57,1.26 65.29,1.26 C4.+ 42.36,0.96 24.57,0.96 J5.1 17.91,7.62 R7.2 | STEPDWN.1 3.18,30.22 3.18,25.15 STEPDWN.4 | 69.11,26.66 REL1.2 73.12,32.74 REL2.2 | ARDUINO_NANO.12 69.11,26.52 69.11,26.66 | 69.11,26.66 | 69.11,26.66 67.73,28.04 D2.C 66.56,29.2 66.2,29.2 63.62,31.78 D1.C
VIN
  Top 0.635: JP2.2
  Top 0.762: 4.77,9.02 9.19,9.02 10.16,9.99 F2.2 JP2.2 | 4.77,9.02 3.39,10.4 3.39,13.96 X4.3 6.08,16.64 10.76,16.64 12.8,18.69 12.8,19.05 C11.1 | 4.77,9.02 X4.1

### Text on the board
tPlace: VCC | GND | VCC
tNames: 100p | + | + | + | 100p | 100p | 100p | 100p | 100p | 100p | TRX | TRV | BIAS | LNA | PA | 100p | Regulator | 470R (or more for LEDs) | + | Sequencer V1.0 / (c) www.neuby.de | 100p | GND | 0,1uF | D8 | + | 10uF | D9 | Fuse / or / Bridge | - | VIn | VCC | Spr | Trx | Trv | BIAS | PA | LNA | GND | LEDs
bNames: Spare | GND | GND | GND | GND | GND | GND | GND | NC | NO | COM | COM | NO | NC | TRX | Trv | BIAS-PA | Relais-PA | LNA | D8 | D9 | Spare | Relais2 | Relais1 | Trv | PA | VCC | GND | UREG | VIN => RAW | VCC | + | Sequencer V1.0 / (c) www.neuby.de | GND | + | VIN | - | 1 | ULN | VIN | - | VCC | Spare | TRX | Trv | BIAS | PA | LNA | GND
tValues: Gehäuse: Aluminiumgehäuse "1590". Auch genannt,"Gitarren Effekt Gehäuse" von Hammond / Oder: beliebig mit Einschub für 100mm Platinen